# Altium schematic sheet LPCB221 - TEMPERATURE.SchDoc
size A3; Address1: Factory 10; Address2: 9-13 Dingley Avenue, Dandeong, VICTORIA 3175, AUSTRALIA; Revision: 1; SheetNumber: 1; SheetTotal: ?; Lockie__PCB_SUB_ASSEMBLY: Temperature Sensors; Lockie__PCB_ASSEMBLY: Node Base; Lockie__LDL: LPCB221; Lockie__PCB_DESCRIPTION: Gimbal Node
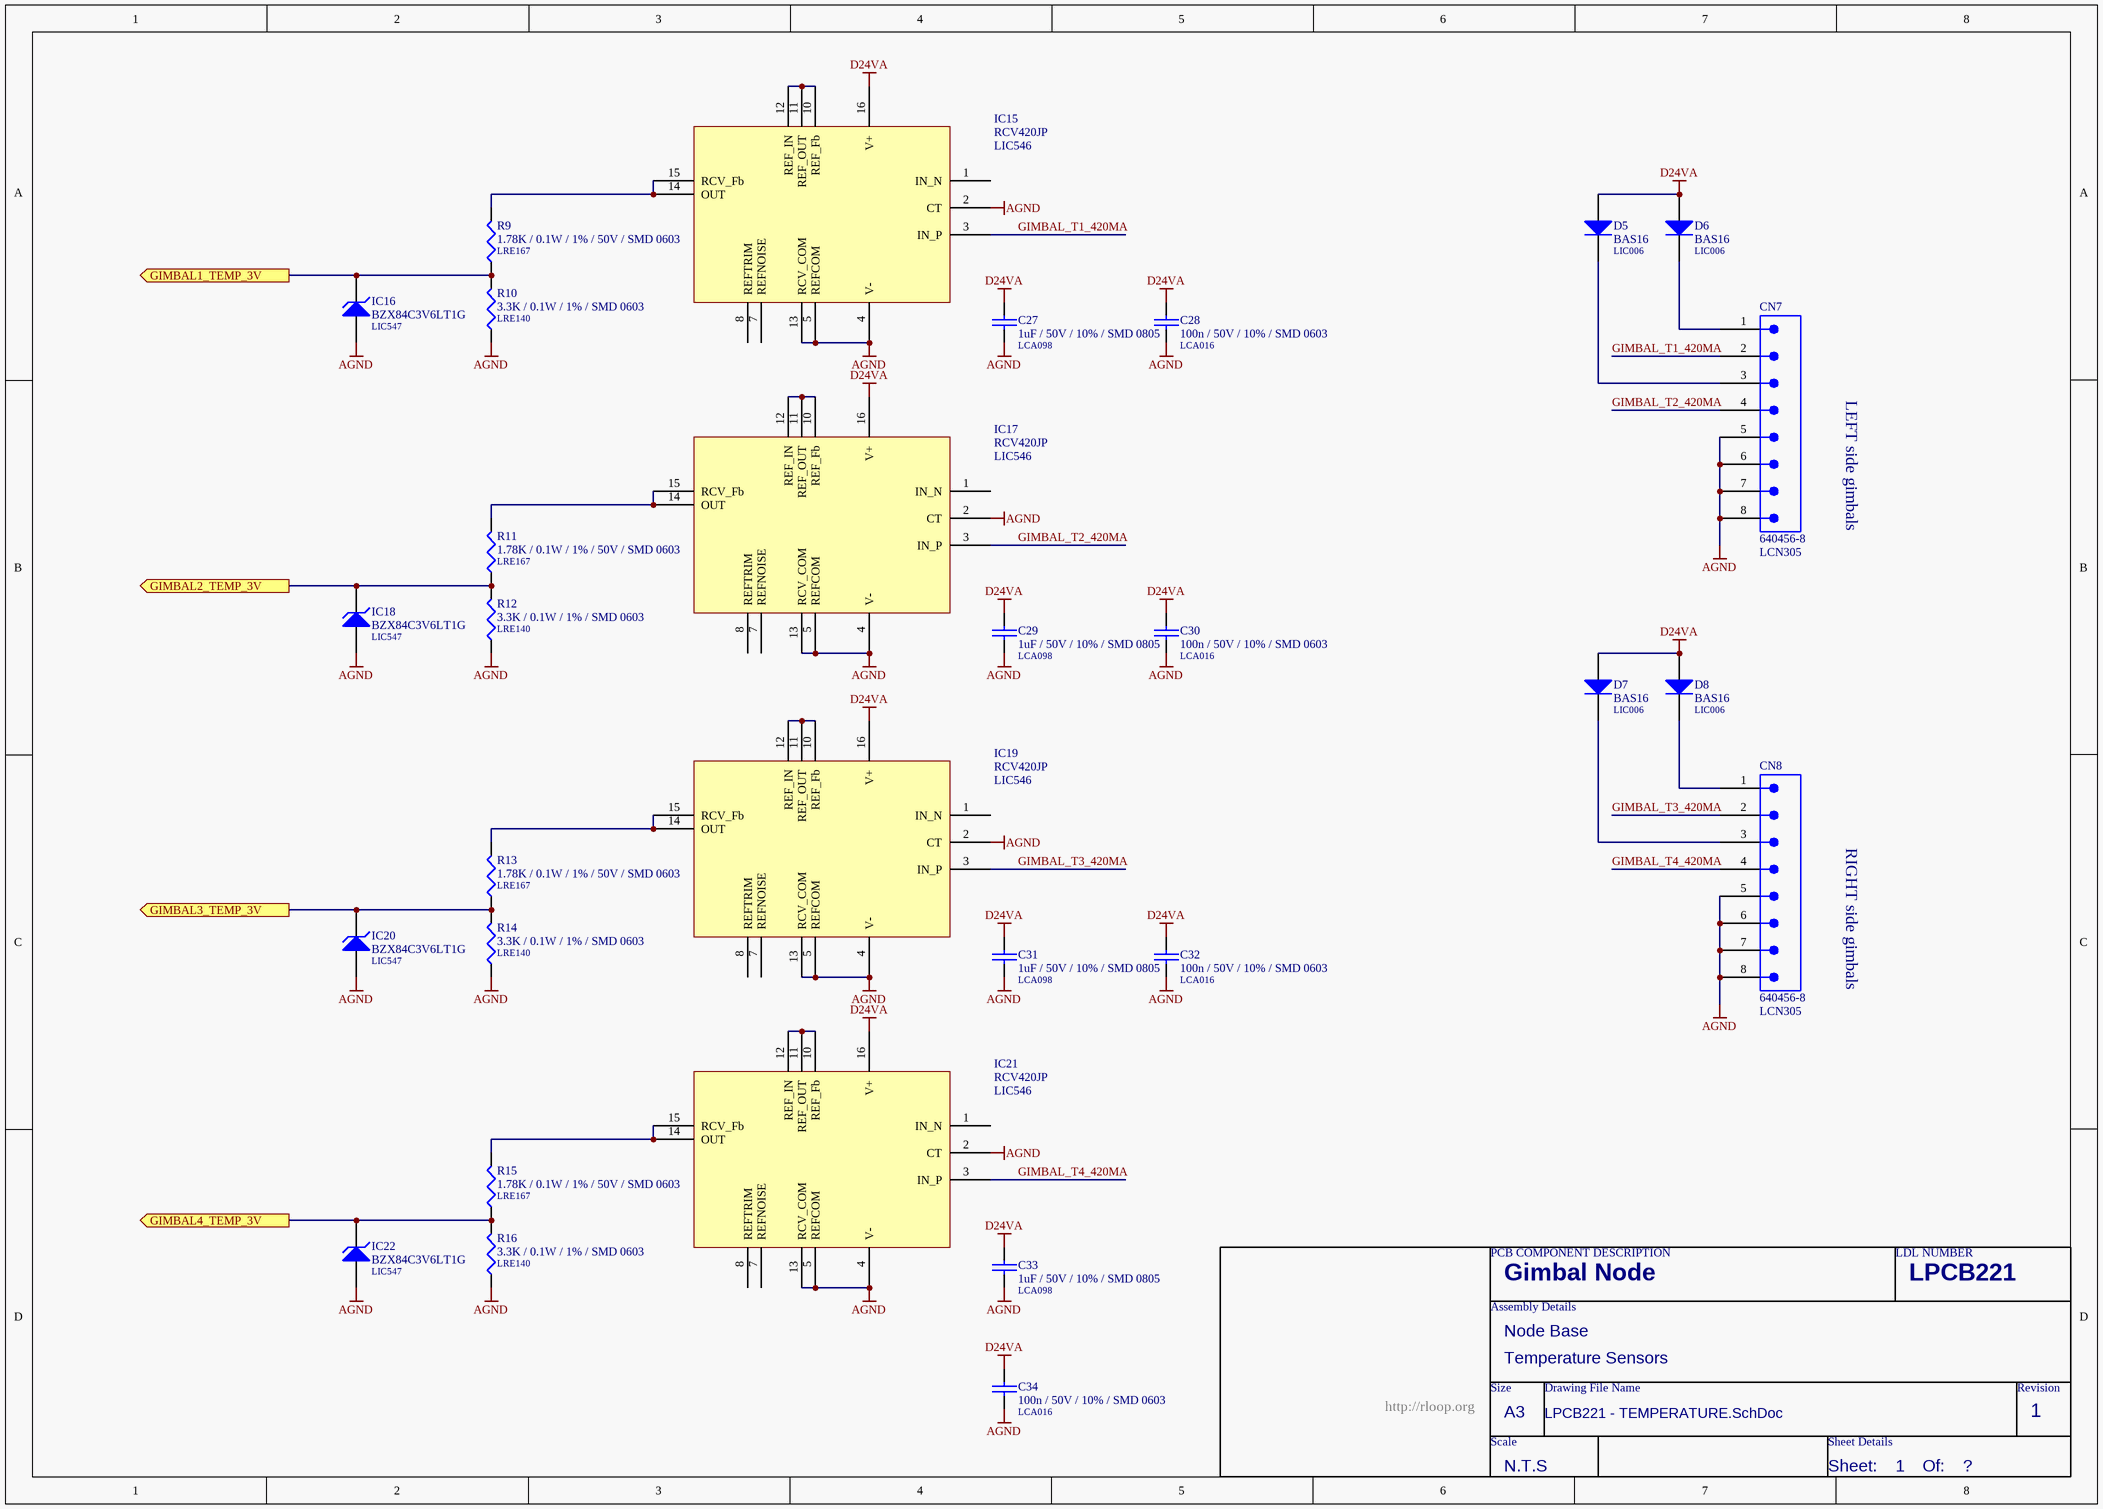
[diagram p0: LPCB221 - TEMPERATURE.SchDoc]

## Parts
C27  1uF / 50V / 10% / SMD 0805  LDL_NUMBER: LCA098  [LFP010__CC2012-0805-IPC7351_B]
C28  100n / 50V / 10% / SMD 0603  LDL_NUMBER: LCA016  [LFP011__CC1608-0603-IPC7351_B]
C29  1uF / 50V / 10% / SMD 0805  LDL_NUMBER: LCA098  [LFP010__CC2012-0805-IPC7351_B]
C30  100n / 50V / 10% / SMD 0603  LDL_NUMBER: LCA016  [LFP011__CC1608-0603-IPC7351_B]
C31  1uF / 50V / 10% / SMD 0805  LDL_NUMBER: LCA098  [LFP010__CC2012-0805-IPC7351_B]
C32  100n / 50V / 10% / SMD 0603  LDL_NUMBER: LCA016  [LFP011__CC1608-0603-IPC7351_B]
C33  1uF / 50V / 10% / SMD 0805  LDL_NUMBER: LCA098  [LFP010__CC2012-0805-IPC7351_B]
C34  100n / 50V / 10% / SMD 0603  LDL_NUMBER: LCA016  [LFP011__CC1608-0603-IPC7351_B]
CN7  640456-8  LDL_NUMBER: LCN305  [640456-8]
CN8  640456-8  LDL_NUMBER: LCN305  [640456-8]
D5  BAS16  LDL_NUMBER: LIC006  [LFP021__SOT23]
D6  BAS16  LDL_NUMBER: LIC006  [LFP021__SOT23]
D7  BAS16  LDL_NUMBER: LIC006  [LFP021__SOT23]
D8  BAS16  LDL_NUMBER: LIC006  [LFP021__SOT23]
IC15  RCV420JP  LDL_NUMBER: LIC546  [DIP-P16/X1.5]
IC16  BZX84C3V6LT1G  LDL_NUMBER: LIC547  [LFP021__SOT23]
IC17  RCV420JP  LDL_NUMBER: LIC546  [DIP-P16/X1.5]
IC18  BZX84C3V6LT1G  LDL_NUMBER: LIC547  [LFP021__SOT23]
IC19  RCV420JP  LDL_NUMBER: LIC546  [DIP-P16/X1.5]
IC20  BZX84C3V6LT1G  LDL_NUMBER: LIC547  [LFP021__SOT23]
IC21  RCV420JP  LDL_NUMBER: LIC546  [DIP-P16/X1.5]
IC22  BZX84C3V6LT1G  LDL_NUMBER: LIC547  [LFP021__SOT23]
R9  1.78K / 0.1W / 1% / 50V / SMD 0603  LDL_NUMBER: LRE167  [LFP020__CR1608-0603-IPC7351_B]
R10  3.3K / 0.1W / 1% / SMD 0603  LDL_NUMBER: LRE140  [LFP020__CR1608-0603-IPC7351_B]
R11  1.78K / 0.1W / 1% / 50V / SMD 0603  LDL_NUMBER: LRE167  [LFP020__CR1608-0603-IPC7351_B]
R12  3.3K / 0.1W / 1% / SMD 0603  LDL_NUMBER: LRE140  [LFP020__CR1608-0603-IPC7351_B]
R13  1.78K / 0.1W / 1% / 50V / SMD 0603  LDL_NUMBER: LRE167  [LFP020__CR1608-0603-IPC7351_B]
R14  3.3K / 0.1W / 1% / SMD 0603  LDL_NUMBER: LRE140  [LFP020__CR1608-0603-IPC7351_B]
R15  1.78K / 0.1W / 1% / 50V / SMD 0603  LDL_NUMBER: LRE167  [LFP020__CR1608-0603-IPC7351_B]
R16  3.3K / 0.1W / 1% / SMD 0603  LDL_NUMBER: LRE140  [LFP020__CR1608-0603-IPC7351_B]

## Ports
GIMBAL1_TEMP_3V (out), GIMBAL2_TEMP_3V (out), GIMBAL3_TEMP_3V (out), GIMBAL4_TEMP_3V (out)

## Nets
AGND: C27.2 C28.2 C29.2 C30.2 C31.2 C32.2 C33.2 C34.2 CN7.5 CN7.6 CN7.7 CN7.8 CN8.5 CN8.6 CN8.7 CN8.8 IC15.2(CT) IC15.4(V-) IC15.5(REFCOM) IC15.13(RCV_COM) IC16.1(A) IC17.2(CT) IC17.4(V-) IC17.5(REFCOM) IC17.13(RCV_COM) IC18.1(A) IC19.2(CT) IC19.4(V-) IC19.5(REFCOM) IC19.13(RCV_COM) IC20.1(A) IC21.2(CT) IC21.4(V-) IC21.5(REFCOM) IC21.13(RCV_COM) IC22.1(A) R10.1 R12.1 R14.1 R16.1
D24VA: C27.1 C28.1 C29.1 C30.1 C31.1 C32.1 C33.1 C34.1 D5.1(A) D6.1(A) D7.1(A) D8.1(A) IC15.16(V+) IC17.16(V+) IC19.16(V+) IC21.16(V+)
GIMBAL1_TEMP_3V: IC16.3(K) R9.1 R10.2 ; port GIMBAL1_TEMP_3V
GIMBAL2_TEMP_3V: IC18.3(K) R11.1 R12.2 ; port GIMBAL2_TEMP_3V
GIMBAL3_TEMP_3V: IC20.3(K) R13.1 R14.2 ; port GIMBAL3_TEMP_3V
GIMBAL4_TEMP_3V: IC22.3(K) R15.1 R16.2 ; port GIMBAL4_TEMP_3V
GIMBAL_T1_420MA: CN7.2 IC15.3(IN_P)
GIMBAL_T2_420MA: CN7.4 IC17.3(IN_P)
GIMBAL_T3_420MA: CN8.2 IC19.3(IN_P)
GIMBAL_T4_420MA: CN8.4 IC21.3(IN_P)
NetCN7_1: CN7.1 D6.3(K)
NetCN7_3: CN7.3 D5.3(K)
NetCN8_1: CN8.1 D8.3(K)
NetCN8_3: CN8.3 D7.3(K)
NetIC15_10: IC15.10(REF_Fb) IC15.11(REF_OUT) IC15.12(REF_IN)
NetIC15_14: IC15.14(OUT) IC15.15(RCV_Fb) R9.2
NetIC17_10: IC17.10(REF_Fb) IC17.11(REF_OUT) IC17.12(REF_IN)
NetIC17_14: IC17.14(OUT) IC17.15(RCV_Fb) R11.2
NetIC19_10: IC19.10(REF_Fb) IC19.11(REF_OUT) IC19.12(REF_IN)
NetIC19_14: IC19.14(OUT) IC19.15(RCV_Fb) R13.2
NetIC21_10: IC21.10(REF_Fb) IC21.11(REF_OUT) IC21.12(REF_IN)
NetIC21_14: IC21.14(OUT) IC21.15(RCV_Fb) R15.2

Not connected (* = marked no-connect by the designer): IC15 1(IN_N) 7(REFNOISE) 8(REFTRIM); IC17 1(IN_N) 7(REFNOISE) 8(REFTRIM); IC19 1(IN_N) 7(REFNOISE) 8(REFTRIM); IC21 1(IN_N) 7(REFNOISE) 8(REFTRIM)

## Notes on the sheet
- LEFT side gimbals
- RIGHT side gimbals
- PCB COMPONENT DESCRIPTION
- LDL NUMBER
- Assembly Details
- Size
- Drawing File Name
- Revision
- http://rloop.org
- Scale
- A3
- Sheet Details
- N.T.S
- Sheet:
- Of:

## Library data of the parts
C27 C29 C31 C33 = 1uF / 50V / 10% / SMD 0805: Capacitor, Ceramic Chip, 1uF, 50V, SMD 0805 [LCA098]; Value: 1u; FMEDA__OPERATING__VOLTAGE_MAX: 3.3; FMEDA__OPERATING__VOLTAGE_MIN: 0; FMEDA__OPERATING__TEMP_MAX: 50; FMEDA__OPERATING__TEMP_MIN: -20; FMEDA__OPERATING__TEMP_TYP: 27; FMEDA__CHANNEL: COM; FMEDA__OPERATING__VOLTAGE_TYP: 3.3; FMEDA__FUNCTION_IN_SYSTEM: *
  C27: ClassName: TEMP1
  C29: ClassName: TEMP2
  C31: ClassName: TEMP3
  C33: ClassName: TEMP4
C28 C30 C32 C34 = 100n / 50V / 10% / SMD 0603: Capacitor, Ceramic Chip, 100nF (0.1uF), 50V, 5%, SMD 0603 [LCA016]; FMEDA__OPERATING__VOLTAGE_MIN: 0; FMEDA__OPERATING__VOLTAGE_MAX: 3.3; FMEDA__OPERATING__TEMP_MIN: -20; FMEDA__OPERATING__TEMP_TYP: 27; FMEDA__OPERATING__TEMP_MAX: 50; FMEDA__CHANNEL: COM; Value: 100n; FMEDA__FUNCTION_IN_SYSTEM: *; FMEDA__OPERATING__VOLTAGE_TYP: 3.3
  C28: ClassName: TEMP1
  C30: ClassName: TEMP2
  C32: ClassName: TEMP3
  C34: ClassName: TEMP4
CN7 CN8 = 640456-8: Connector, Male Header, 8 Way; FMEDA__CHANNEL: COM; FMEDA__OPERATING__CURRENT_MAX: 0; FMEDA__OPERATING__TEMP_MAX: 50; FMEDA__OPERATING__TEMP_MIN: -20; FMEDA__OPERATING__TEMP_TYP: 27; FMEDA__OPERATING__VOLTAGE_MAX: 16; FMEDA__OPERATING__VOLTAGE_TYP: 12; FMEDA__FUNCTION_IN_SYSTEM: *; FMEDA__OPERATING__CURRENT_MIN: 0; FMEDA__OPERATING__CURRENT_TYP: 0; FMEDA__OPERATING__VOLTAGE_MIN: 0
D5-D8 = BAS16: Diode, Small Signal, 0.2A, 85V, SMD SOT-23 [LIC006]; FMEDA__OPERATING__CURRENT_MIN: 0; FMEDA__OPERATING__TEMP_MIN: -20; FMEDA__OPERATING__TEMP_TYP: 27; FMEDA__OPERATING__TEMP_MAX: 50; FMEDA__CHANNEL: COM; FMEDA__OPERATING__CURRENT_MAX: 0; FMEDA__OPERATING__VOLTAGE_MIN: 0; FMEDA__OPERATING__VOLTAGE_MAX: 0; FMEDA__FUNCTION_IN_SYSTEM: *; FMEDA__OPERATING__CURRENT_TYP: 0; FMEDA__OPERATING__VOLTAGE_TYP: 0
IC15 IC17 IC19 IC21 = RCV420JP: IC, 4-20mA Interface, DIP16 [LIC546]
  IC15: ClassName: TEMP1
  IC17: ClassName: TEMP2
  IC19: ClassName: TEMP3
  IC21: ClassName: TEMP4
IC16 IC18 IC20 IC22 = BZX84C3V6LT1G: Diode, Zener, 3.6V, 0.225W, SMD [LIC083]; FMEDA__OPERATING__TEMP_MAX: 50; FMEDA__OPERATING__TEMP_MIN: -20; FMEDA__OPERATING__TEMP_TYP: 27; FMEDA__OPERATING__VOLTAGE_MAX: 0; FMEDA__CHANNEL: COM; Revision: 17-Jul-2002: Re-released for DXP Platform.; FMEDA__FUNCTION_IN_SYSTEM: *; FMEDA__OPERATING__VOLTAGE_MIN: 0; FMEDA__OPERATING__VOLTAGE_TYP: 0; FMEDA__OPERATING__CURRENT_MAX: 0; FMEDA__OPERATING__CURRENT_MIN: 0; FMEDA__OPERATING__CURRENT_TYP: 0
  IC16: ClassName: TEMP1
  IC18: ClassName: TEMP2
  IC20: ClassName: TEMP3
  IC22: ClassName: TEMP4
R9 R11 R13 R15 = 1.78K / 0.1W / 1% / 50V / SMD 0603: Resistor, Ceramic Chip, 1.78K, 0.1W, 1%, SMD 0603 [LRE167]; FMEDA__OPERATING__POWER_MAX: 0.01; FMEDA__OPERATING__POWER_MIN: 0; FMEDA__OPERATING__TEMP_MAX: 50; FMEDA__OPERATING__TEMP_MIN: -20; FMEDA__OPERATING__TEMP_TYP: 27; FMEDA__CHANNEL: COM; Value: 1.78K; FMEDA__OPERATING__VOLTAGE_MAX: 0; FMEDA__OPERATING__VOLTAGE_MIN: 0; FMEDA__OPERATING__VOLTAGE_TYP: 0; FMEDA__FUNCTION_IN_SYSTEM: *
  R9: ClassName: TEMP1
  R11: ClassName: TEMP2
  R13: ClassName: TEMP3
  R15: ClassName: TEMP4
R10 R12 R14 R16 = 3.3K / 0.1W / 1% / SMD 0603: Resistor, Ceramic Chip, 3.3K0, 0.1W, 1%, SMD 0603 [LRE140]; FMEDA__OPERATING__POWER_MAX: 0; FMEDA__OPERATING__TEMP_MAX: 50; FMEDA__OPERATING__TEMP_MIN: -20; FMEDA__OPERATING__TEMP_TYP: 27; FMEDA__CHANNEL: COM; Value: 3.3K; FMEDA__OPERATING__POWER_MIN: 0; FMEDA__OPERATING__VOLTAGE_MAX: 0; FMEDA__OPERATING__VOLTAGE_MIN: 0; FMEDA__OPERATING__VOLTAGE_TYP: 0; FMEDA__FUNCTION_IN_SYSTEM: *
  R10: ClassName: TEMP1
  R12: ClassName: TEMP2
  R14: ClassName: TEMP3
  R16: ClassName: TEMP4